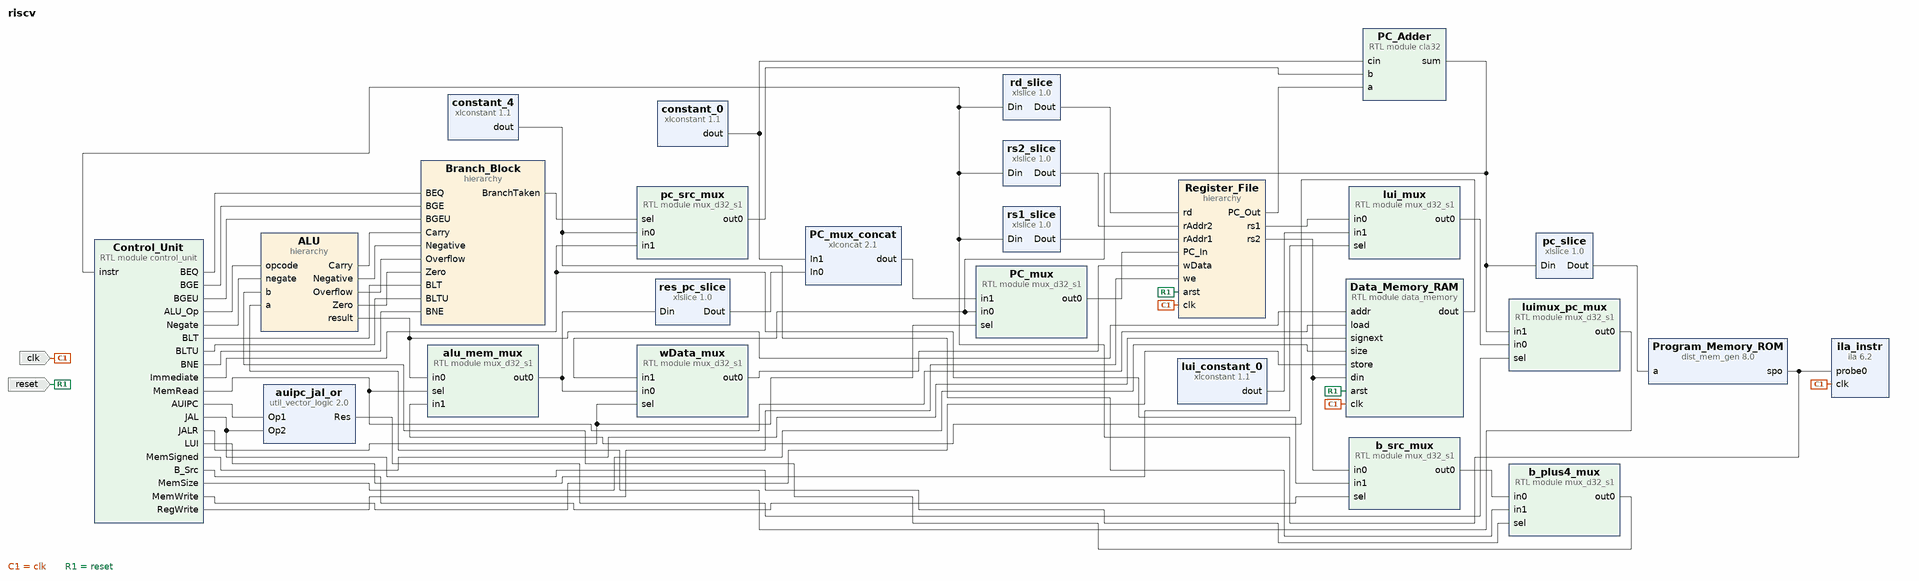
[diagram p0: block diagram of the top level]
# Vivado block design riscv, xc7z020clg400-1, Vivado 2024.1
create_bd_design riscv

create_bd_port -dir I -type clk clk
create_bd_port -dir I reset

create_bd_cell -type module -reference data_memory Data_Memory_RAM
create_bd_cell -type hier Register_File
create_bd_cell -type hier ALU
create_bd_cell -type ip -vlnv xilinx.com:ip:dist_mem_gen:8.0 Program_Memory_ROM
set_property -dict [list \
  CONFIG.coefficient_file Test_Programs/RV32I/rv32ui-p-addi.coe \
  CONFIG.data_width 32 \
  CONFIG.depth 1024 \
  CONFIG.memory_type rom \
] [get_bd_cells Program_Memory_ROM]
create_bd_cell -type module -reference control_unit Control_Unit
create_bd_cell -type ip -vlnv xilinx.com:ip:xlslice:1.0 pc_slice
set_property -dict {CONFIG.DIN_FROM 9 CONFIG.DOUT_WIDTH 10} [get_bd_cells pc_slice]
create_bd_cell -type module -reference cla32 PC_Adder
create_bd_cell -type ip -vlnv xilinx.com:ip:xlconstant:1.1 constant_4
set_property -dict {CONFIG.CONST_VAL 4 CONFIG.CONST_WIDTH 32} [get_bd_cells constant_4]
create_bd_cell -type ip -vlnv xilinx.com:ip:xlconstant:1.1 constant_0
set_property -dict {CONFIG.CONST_VAL 0 CONFIG.CONST_WIDTH 1} [get_bd_cells constant_0]
create_bd_cell -type ip -vlnv xilinx.com:ip:xlslice:1.0 rd_slice
set_property -dict {CONFIG.DIN_FROM 11 CONFIG.DIN_TO 7} [get_bd_cells rd_slice]
create_bd_cell -type ip -vlnv xilinx.com:ip:xlslice:1.0 rs1_slice
set_property -dict {CONFIG.DIN_FROM 19 CONFIG.DIN_TO 15} [get_bd_cells rs1_slice]
create_bd_cell -type ip -vlnv xilinx.com:ip:xlslice:1.0 rs2_slice
set_property -dict {CONFIG.DIN_FROM 24 CONFIG.DIN_TO 20} [get_bd_cells rs2_slice]
create_bd_cell -type module -reference mux_d32_s1 b_src_mux
create_bd_cell -type module -reference mux_d32_s1 alu_mem_mux
create_bd_cell -type hier Branch_Block
create_bd_cell -type module -reference mux_d32_s1 pc_src_mux
create_bd_cell -type module -reference mux_d32_s1 lui_mux
create_bd_cell -type ip -vlnv xilinx.com:ip:xlconstant:1.1 lui_constant_0
set_property -dict {CONFIG.CONST_VAL 0 CONFIG.CONST_WIDTH 32} [get_bd_cells lui_constant_0]
create_bd_cell -type ip -vlnv xilinx.com:ip:util_vector_logic:2.0 auipc_jal_or
set_property -dict {CONFIG.C_OPERATION or CONFIG.C_SIZE 1} [get_bd_cells auipc_jal_or]
create_bd_cell -type module -reference mux_d32_s1 luimux_pc_mux
create_bd_cell -type module -reference mux_d32_s1 b_plus4_mux
create_bd_cell -type module -reference mux_d32_s1 wData_mux
create_bd_cell -type module -reference mux_d32_s1 PC_mux
create_bd_cell -type ip -vlnv xilinx.com:ip:xlconcat:2.1 PC_mux_concat
set_property -dict {CONFIG.IN0_WIDTH 31 CONFIG.IN1_WIDTH 1} [get_bd_cells PC_mux_concat]
create_bd_cell -type ip -vlnv xilinx.com:ip:xlslice:1.0 res_pc_slice
set_property -dict {CONFIG.DIN_FROM 31 CONFIG.DIN_TO 1} [get_bd_cells res_pc_slice]
create_bd_cell -type ip -vlnv xilinx.com:ip:ila:6.2 ila_instr
set_property -dict {CONFIG.C_MONITOR_TYPE Native CONFIG.C_PROBE0_WIDTH 32} [get_bd_cells ila_instr]

# ---- hierarchy /Register_File ----
current_bd_instance /Register_File
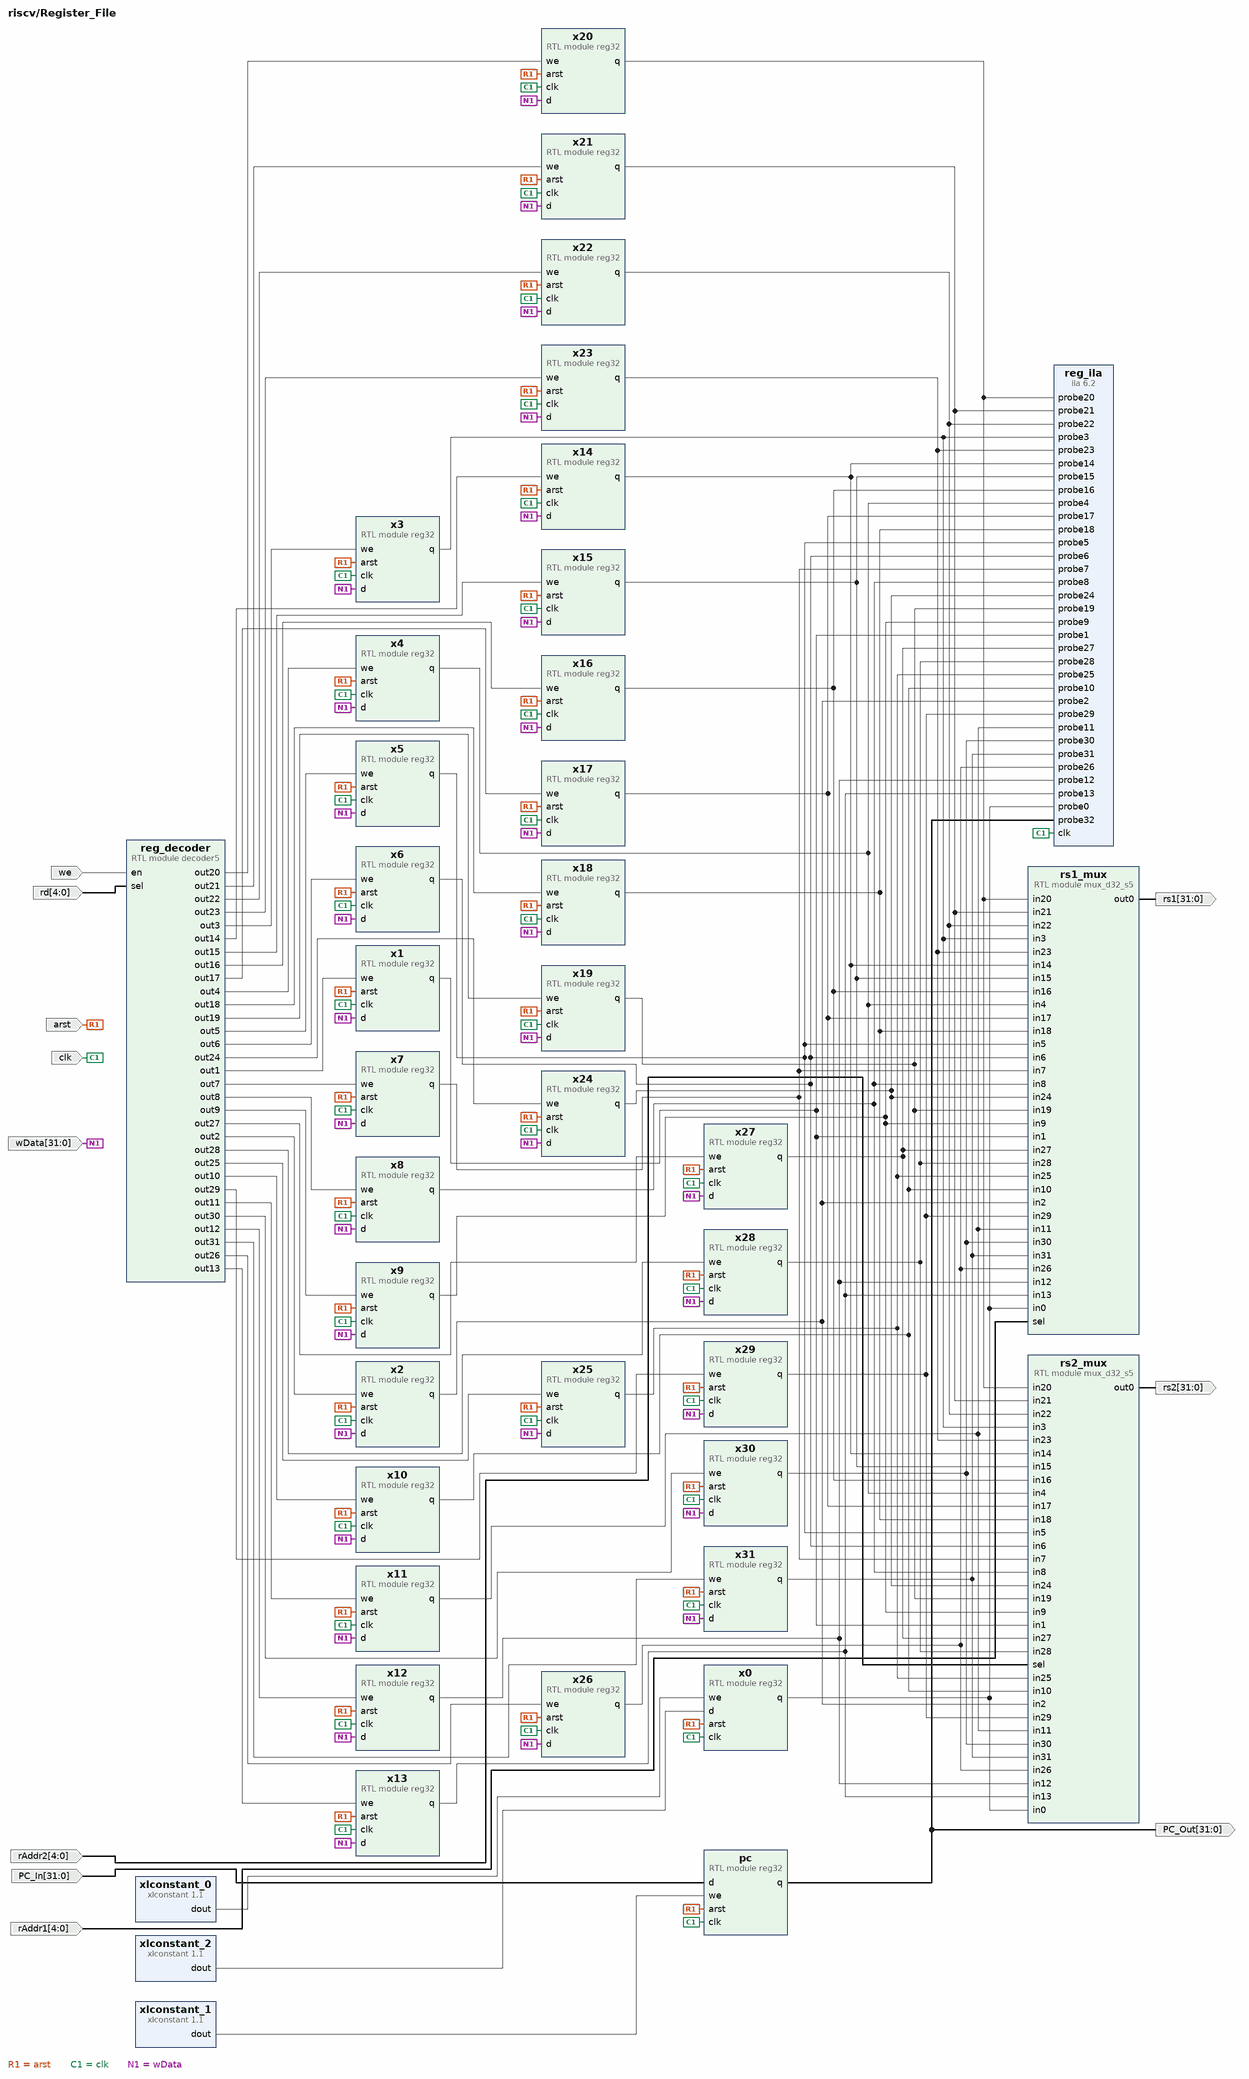
[diagram p1: block diagram inside /Register_File]
create_bd_pin -dir I -type clk clk
create_bd_pin -dir I arst
create_bd_pin -dir I -from 31 -to 0 wData
create_bd_pin -dir O -from 31 -to 0 PC_Out
create_bd_pin -dir I -from 31 -to 0 PC_In
create_bd_pin -dir I we
create_bd_pin -dir I -from 4 -to 0 rd
create_bd_pin -dir O -from 31 -to 0 rs1
create_bd_pin -dir O -from 31 -to 0 rs2
create_bd_pin -dir I -from 4 -to 0 rAddr1
create_bd_pin -dir I -from 4 -to 0 rAddr2

create_bd_cell -type module -reference reg32 x0
create_bd_cell -type module -reference reg32 x1
create_bd_cell -type module -reference reg32 x2
create_bd_cell -type module -reference reg32 x3
create_bd_cell -type module -reference reg32 x4
create_bd_cell -type module -reference reg32 x5
create_bd_cell -type module -reference reg32 x6
create_bd_cell -type module -reference reg32 x7
create_bd_cell -type module -reference reg32 x8
create_bd_cell -type module -reference reg32 x9
create_bd_cell -type module -reference reg32 x10
create_bd_cell -type module -reference reg32 x11
create_bd_cell -type module -reference reg32 x12
create_bd_cell -type module -reference reg32 x13
create_bd_cell -type module -reference reg32 x14
create_bd_cell -type module -reference reg32 x15
create_bd_cell -type module -reference reg32 x16
create_bd_cell -type module -reference reg32 x17
create_bd_cell -type module -reference reg32 x18
create_bd_cell -type module -reference reg32 x19
create_bd_cell -type module -reference reg32 x20
create_bd_cell -type module -reference reg32 x21
create_bd_cell -type module -reference reg32 x22
create_bd_cell -type module -reference reg32 x23
create_bd_cell -type module -reference reg32 x24
create_bd_cell -type module -reference reg32 x25
create_bd_cell -type module -reference reg32 x26
create_bd_cell -type module -reference reg32 x27
create_bd_cell -type module -reference reg32 x28
create_bd_cell -type module -reference reg32 x29
create_bd_cell -type module -reference reg32 x30
create_bd_cell -type module -reference reg32 x31
create_bd_cell -type module -reference reg32 pc
create_bd_cell -type ip -vlnv xilinx.com:ip:xlconstant:1.1 xlconstant_0
set_property -dict {CONFIG.CONST_VAL 0} [get_bd_cells xlconstant_0]
create_bd_cell -type ip -vlnv xilinx.com:ip:xlconstant:1.1 xlconstant_1
set_property -dict {CONFIG.CONST_VAL 1} [get_bd_cells xlconstant_1]
create_bd_cell -type module -reference decoder5 reg_decoder
create_bd_cell -type module -reference mux_d32_s5 rs1_mux
create_bd_cell -type module -reference mux_d32_s5 rs2_mux
create_bd_cell -type ip -vlnv xilinx.com:ip:xlconstant:1.1 xlconstant_2
set_property -dict {CONFIG.CONST_VAL 0 CONFIG.CONST_WIDTH 32} [get_bd_cells xlconstant_2]
create_bd_cell -type ip -vlnv xilinx.com:ip:ila:6.2 reg_ila
set_property -dict [list \
  CONFIG.C_MONITOR_TYPE Native \
  CONFIG.C_NUM_OF_PROBES 33 \
  CONFIG.C_PROBE0_WIDTH 32 \
  CONFIG.C_PROBE10_WIDTH 32 \
  CONFIG.C_PROBE11_WIDTH 32 \
  CONFIG.C_PROBE12_WIDTH 32 \
  CONFIG.C_PROBE13_WIDTH 32 \
  CONFIG.C_PROBE14_WIDTH 32 \
  CONFIG.C_PROBE15_WIDTH 32 \
  CONFIG.C_PROBE16_WIDTH 32 \
  CONFIG.C_PROBE17_WIDTH 32 \
  CONFIG.C_PROBE18_WIDTH 32 \
  CONFIG.C_PROBE19_WIDTH 32 \
  CONFIG.C_PROBE1_WIDTH 32 \
  CONFIG.C_PROBE20_WIDTH 32 \
  CONFIG.C_PROBE21_WIDTH 32 \
  CONFIG.C_PROBE22_WIDTH 32 \
  CONFIG.C_PROBE23_WIDTH 32 \
  CONFIG.C_PROBE24_WIDTH 32 \
  CONFIG.C_PROBE25_WIDTH 32 \
  CONFIG.C_PROBE26_WIDTH 32 \
  CONFIG.C_PROBE27_WIDTH 32 \
  CONFIG.C_PROBE28_WIDTH 32 \
  CONFIG.C_PROBE29_WIDTH 32 \
  CONFIG.C_PROBE2_WIDTH 32 \
  CONFIG.C_PROBE30_WIDTH 32 \
  CONFIG.C_PROBE31_WIDTH 32 \
  CONFIG.C_PROBE32_WIDTH 32 \
  CONFIG.C_PROBE3_WIDTH 32 \
  CONFIG.C_PROBE4_WIDTH 32 \
  CONFIG.C_PROBE5_WIDTH 32 \
  CONFIG.C_PROBE6_WIDTH 32 \
  CONFIG.C_PROBE7_WIDTH 32 \
  CONFIG.C_PROBE8_WIDTH 32 \
  CONFIG.C_PROBE9_WIDTH 32 \
] [get_bd_cells reg_ila]

# ---- hierarchy /ALU ----
current_bd_instance /ALU
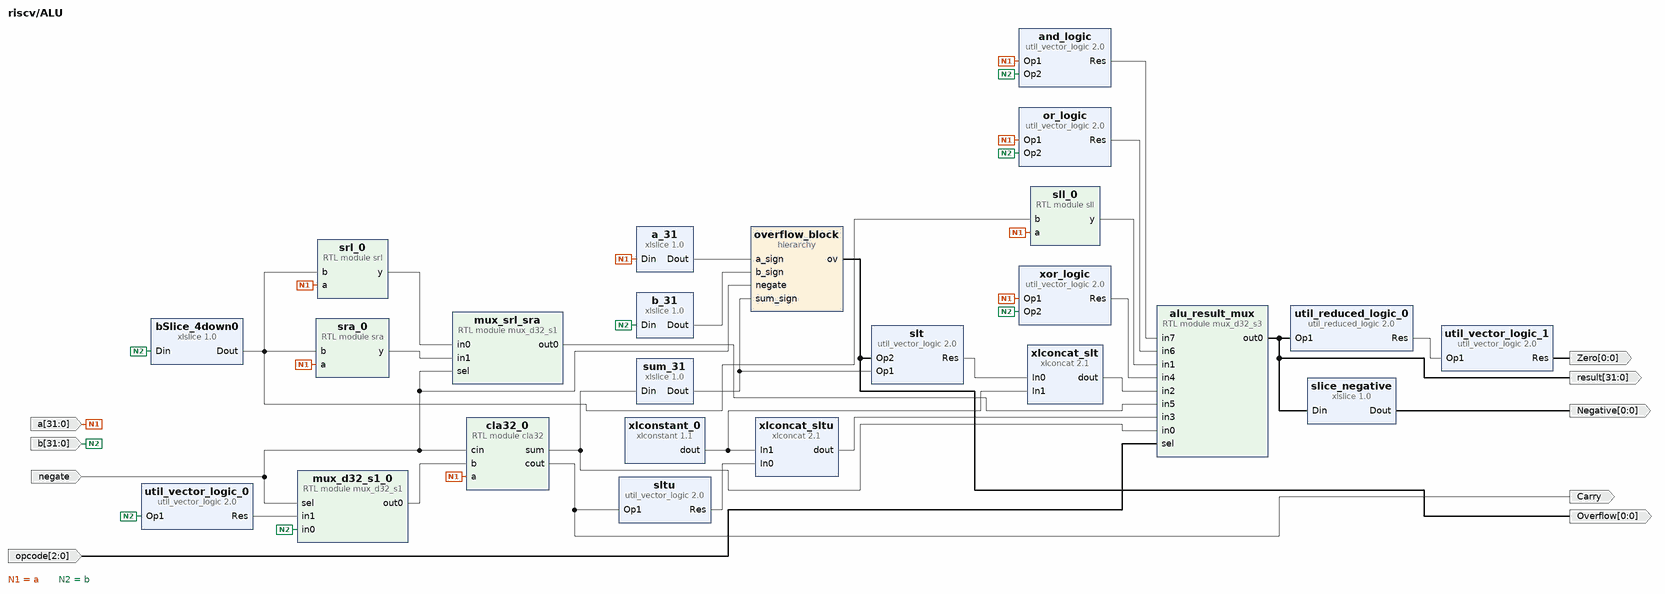
[diagram p2: block diagram inside /ALU]
create_bd_pin -dir I -from 31 -to 0 a
create_bd_pin -dir I -from 31 -to 0 b
create_bd_pin -dir I negate
create_bd_pin -dir I -from 2 -to 0 opcode
create_bd_pin -dir O -from 31 -to 0 result
create_bd_pin -dir O Carry
create_bd_pin -dir O -from 0 -to 0 Negative
create_bd_pin -dir O -from 0 -to 0 Zero
create_bd_pin -dir O -from 0 -to 0 Overflow

create_bd_cell -type module -reference cla32 cla32_0
create_bd_cell -type module -reference mux_d32_s1 mux_d32_s1_0
create_bd_cell -type module -reference sll sll_0
create_bd_cell -type ip -vlnv xilinx.com:ip:xlslice:1.0 bSlice_4down0
set_property -dict {CONFIG.DIN_FROM 4} [get_bd_cells bSlice_4down0]
create_bd_cell -type ip -vlnv xilinx.com:ip:util_vector_logic:2.0 slt
set_property -dict {CONFIG.C_OPERATION xor CONFIG.C_SIZE 1} [get_bd_cells slt]
create_bd_cell -type ip -vlnv xilinx.com:ip:util_vector_logic:2.0 sltu
set_property -dict {CONFIG.C_OPERATION not CONFIG.C_SIZE 1} [get_bd_cells sltu]
create_bd_cell -type ip -vlnv xilinx.com:ip:xlconcat:2.1 xlconcat_slt
set_property -dict {CONFIG.IN0_WIDTH 1 CONFIG.IN1_WIDTH 31} [get_bd_cells xlconcat_slt]
create_bd_cell -type ip -vlnv xilinx.com:ip:xlconstant:1.1 xlconstant_0
set_property -dict {CONFIG.CONST_VAL 0 CONFIG.CONST_WIDTH 31} [get_bd_cells xlconstant_0]
create_bd_cell -type ip -vlnv xilinx.com:ip:xlconcat:2.1 xlconcat_sltu
set_property -dict {CONFIG.IN0_WIDTH 1 CONFIG.IN1_WIDTH 31} [get_bd_cells xlconcat_sltu]
create_bd_cell -type ip -vlnv xilinx.com:ip:xlslice:1.0 sum_31
set_property -dict {CONFIG.DIN_FROM 31 CONFIG.DIN_TO 31} [get_bd_cells sum_31]
create_bd_cell -type ip -vlnv xilinx.com:ip:util_vector_logic:2.0 xor_logic
set_property -dict {CONFIG.C_OPERATION xor CONFIG.C_SIZE 32} [get_bd_cells xor_logic]
create_bd_cell -type module -reference srl srl_0
create_bd_cell -type module -reference sra sra_0
create_bd_cell -type module -reference mux_d32_s1 mux_srl_sra
create_bd_cell -type ip -vlnv xilinx.com:ip:util_vector_logic:2.0 or_logic
set_property -dict {CONFIG.C_OPERATION or CONFIG.C_SIZE 32} [get_bd_cells or_logic]
create_bd_cell -type ip -vlnv xilinx.com:ip:util_vector_logic:2.0 and_logic
set_property -dict {CONFIG.C_SIZE 32} [get_bd_cells and_logic]
create_bd_cell -type module -reference mux_d32_s3 alu_result_mux
create_bd_cell -type ip -vlnv xilinx.com:ip:xlslice:1.0 slice_negative
set_property -dict {CONFIG.DIN_FROM 31 CONFIG.DIN_TO 31} [get_bd_cells slice_negative]
create_bd_cell -type ip -vlnv xilinx.com:ip:util_reduced_logic:2.0 util_reduced_logic_0
set_property -dict {CONFIG.C_OPERATION or CONFIG.C_SIZE 32} [get_bd_cells util_reduced_logic_0]
create_bd_cell -type ip -vlnv xilinx.com:ip:util_vector_logic:2.0 util_vector_logic_1
set_property -dict {CONFIG.C_OPERATION not CONFIG.C_SIZE 1} [get_bd_cells util_vector_logic_1]
create_bd_cell -type hier overflow_block
create_bd_cell -type ip -vlnv xilinx.com:ip:xlslice:1.0 a_31
set_property -dict {CONFIG.DIN_FROM 31 CONFIG.DIN_TO 31} [get_bd_cells a_31]
create_bd_cell -type ip -vlnv xilinx.com:ip:xlslice:1.0 b_31
set_property -dict {CONFIG.DIN_FROM 31 CONFIG.DIN_TO 31} [get_bd_cells b_31]
create_bd_cell -type ip -vlnv xilinx.com:ip:util_vector_logic:2.0 util_vector_logic_0
set_property -dict {CONFIG.C_OPERATION not CONFIG.C_SIZE 32} [get_bd_cells util_vector_logic_0]

# ---- hierarchy /ALU/overflow_block ----
current_bd_instance /ALU/overflow_block
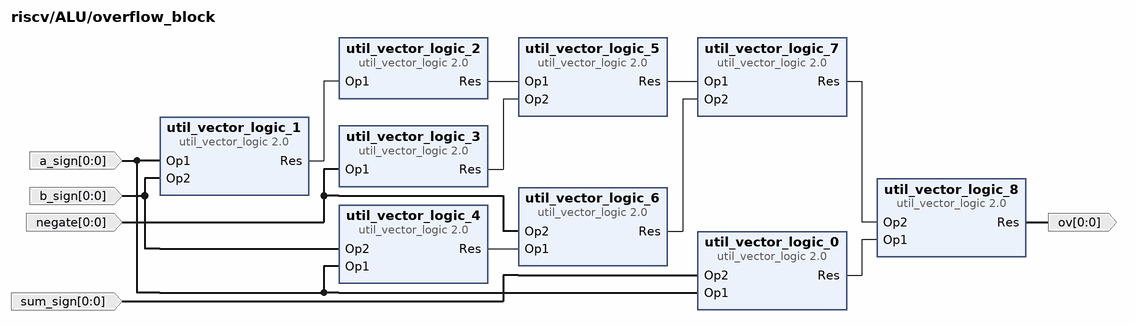
[diagram p3: block diagram inside /ALU/overflow_block]
create_bd_pin -dir I -from 0 -to 0 a_sign
create_bd_pin -dir I -from 0 -to 0 b_sign
create_bd_pin -dir I -from 0 -to 0 sum_sign
create_bd_pin -dir O -from 0 -to 0 ov
create_bd_pin -dir I -from 0 -to 0 negate

create_bd_cell -type ip -vlnv xilinx.com:ip:util_vector_logic:2.0 util_vector_logic_0
set_property -dict {CONFIG.C_OPERATION xor CONFIG.C_SIZE 1} [get_bd_cells util_vector_logic_0]
create_bd_cell -type ip -vlnv xilinx.com:ip:util_vector_logic:2.0 util_vector_logic_1
set_property -dict {CONFIG.C_OPERATION xor CONFIG.C_SIZE 1} [get_bd_cells util_vector_logic_1]
create_bd_cell -type ip -vlnv xilinx.com:ip:util_vector_logic:2.0 util_vector_logic_2
set_property -dict {CONFIG.C_OPERATION not CONFIG.C_SIZE 1} [get_bd_cells util_vector_logic_2]
create_bd_cell -type ip -vlnv xilinx.com:ip:util_vector_logic:2.0 util_vector_logic_3
set_property -dict {CONFIG.C_OPERATION not CONFIG.C_SIZE 1} [get_bd_cells util_vector_logic_3]
create_bd_cell -type ip -vlnv xilinx.com:ip:util_vector_logic:2.0 util_vector_logic_4
set_property -dict {CONFIG.C_OPERATION xor CONFIG.C_SIZE 1} [get_bd_cells util_vector_logic_4]
create_bd_cell -type ip -vlnv xilinx.com:ip:util_vector_logic:2.0 util_vector_logic_5
set_property -dict {CONFIG.C_OPERATION and CONFIG.C_SIZE 1} [get_bd_cells util_vector_logic_5]
create_bd_cell -type ip -vlnv xilinx.com:ip:util_vector_logic:2.0 util_vector_logic_6
set_property -dict {CONFIG.C_OPERATION and CONFIG.C_SIZE 1} [get_bd_cells util_vector_logic_6]
create_bd_cell -type ip -vlnv xilinx.com:ip:util_vector_logic:2.0 util_vector_logic_7
set_property -dict {CONFIG.C_OPERATION or CONFIG.C_SIZE 1} [get_bd_cells util_vector_logic_7]
create_bd_cell -type ip -vlnv xilinx.com:ip:util_vector_logic:2.0 util_vector_logic_8
set_property -dict {CONFIG.C_OPERATION and CONFIG.C_SIZE 1} [get_bd_cells util_vector_logic_8]

# ---- hierarchy /Branch_Block ----
current_bd_instance /Branch_Block
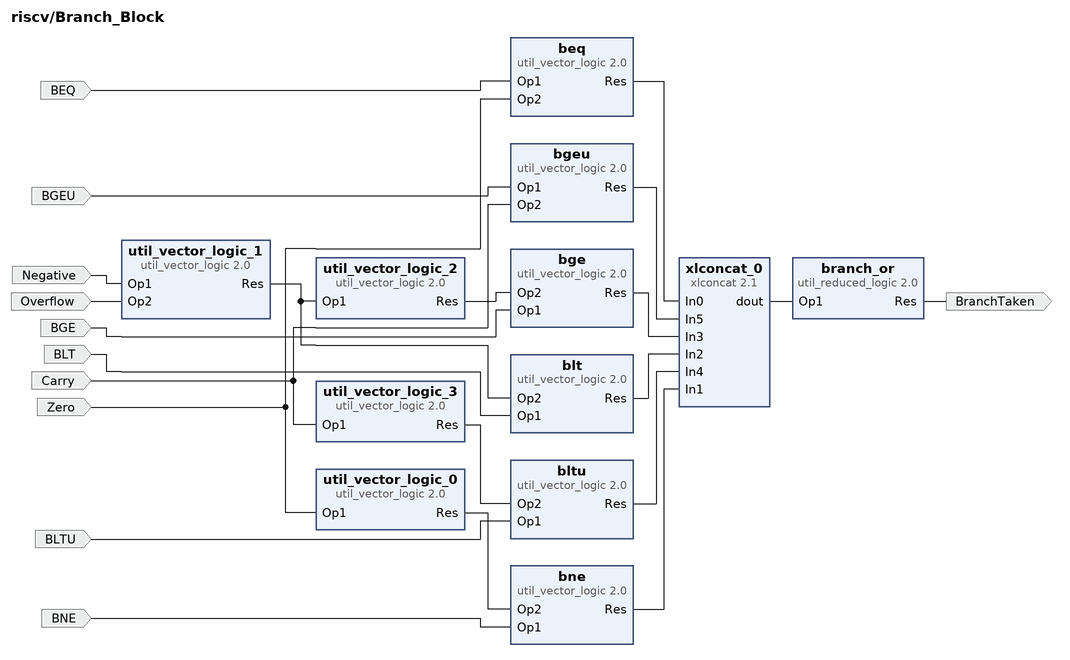
[diagram p4: block diagram inside /Branch_Block]
create_bd_pin -dir I Negative
create_bd_pin -dir I Zero
create_bd_pin -dir I Carry
create_bd_pin -dir I Overflow
create_bd_pin -dir I BEQ
create_bd_pin -dir I BNE
create_bd_pin -dir I BLT
create_bd_pin -dir I BGE
create_bd_pin -dir I BLTU
create_bd_pin -dir I BGEU
create_bd_pin -dir O BranchTaken

create_bd_cell -type ip -vlnv xilinx.com:ip:util_vector_logic:2.0 beq
set_property -dict {CONFIG.C_SIZE 1} [get_bd_cells beq]
create_bd_cell -type ip -vlnv xilinx.com:ip:util_vector_logic:2.0 bne
set_property -dict {CONFIG.C_SIZE 1} [get_bd_cells bne]
create_bd_cell -type ip -vlnv xilinx.com:ip:util_vector_logic:2.0 bltu
set_property -dict {CONFIG.C_SIZE 1} [get_bd_cells bltu]
create_bd_cell -type ip -vlnv xilinx.com:ip:util_vector_logic:2.0 blt
set_property -dict {CONFIG.C_SIZE 1} [get_bd_cells blt]
create_bd_cell -type ip -vlnv xilinx.com:ip:util_vector_logic:2.0 bge
set_property -dict {CONFIG.C_SIZE 1} [get_bd_cells bge]
create_bd_cell -type ip -vlnv xilinx.com:ip:util_vector_logic:2.0 bgeu
set_property -dict {CONFIG.C_SIZE 1} [get_bd_cells bgeu]
create_bd_cell -type ip -vlnv xilinx.com:ip:xlconcat:2.1 xlconcat_0
set_property -dict {CONFIG.NUM_PORTS 6} [get_bd_cells xlconcat_0]
create_bd_cell -type ip -vlnv xilinx.com:ip:util_reduced_logic:2.0 branch_or
set_property -dict {CONFIG.C_OPERATION or CONFIG.C_SIZE 6} [get_bd_cells branch_or]
create_bd_cell -type ip -vlnv xilinx.com:ip:util_vector_logic:2.0 util_vector_logic_0
set_property -dict {CONFIG.C_OPERATION not CONFIG.C_SIZE 1} [get_bd_cells util_vector_logic_0]
create_bd_cell -type ip -vlnv xilinx.com:ip:util_vector_logic:2.0 util_vector_logic_1
set_property -dict {CONFIG.C_OPERATION xor CONFIG.C_SIZE 1} [get_bd_cells util_vector_logic_1]
create_bd_cell -type ip -vlnv xilinx.com:ip:util_vector_logic:2.0 util_vector_logic_2
set_property -dict {CONFIG.C_OPERATION not CONFIG.C_SIZE 1} [get_bd_cells util_vector_logic_2]
create_bd_cell -type ip -vlnv xilinx.com:ip:util_vector_logic:2.0 util_vector_logic_3
set_property -dict {CONFIG.C_OPERATION not CONFIG.C_SIZE 1} [get_bd_cells util_vector_logic_3]

# ---- connections ----

current_bd_instance /Register_File
connect_bd_net [get_bd_pins x20/q] [get_bd_pins reg_ila/probe20] [get_bd_pins rs1_mux/in20] [get_bd_pins rs2_mux/in20]
connect_bd_net [get_bd_pins x3/q] [get_bd_pins reg_ila/probe3] [get_bd_pins rs1_mux/in3] [get_bd_pins rs2_mux/in3]
connect_bd_net [get_bd_pins x4/q] [get_bd_pins reg_ila/probe4] [get_bd_pins rs1_mux/in4] [get_bd_pins rs2_mux/in4]
connect_bd_net [get_bd_pins x0/q] [get_bd_pins reg_ila/probe0] [get_bd_pins rs1_mux/in0] [get_bd_pins rs2_mux/in0]
connect_bd_net [get_bd_pins x5/q] [get_bd_pins reg_ila/probe5] [get_bd_pins rs1_mux/in5] [get_bd_pins rs2_mux/in5]
connect_bd_net [get_bd_pins x6/q] [get_bd_pins reg_ila/probe6] [get_bd_pins rs1_mux/in6] [get_bd_pins rs2_mux/in6]
connect_bd_net [get_bd_pins x7/q] [get_bd_pins reg_ila/probe7] [get_bd_pins rs1_mux/in7] [get_bd_pins rs2_mux/in7]
connect_bd_net [get_bd_pins x8/q] [get_bd_pins reg_ila/probe8] [get_bd_pins rs1_mux/in8] [get_bd_pins rs2_mux/in8]
connect_bd_net [get_bd_pins x9/q] [get_bd_pins reg_ila/probe9] [get_bd_pins rs1_mux/in9] [get_bd_pins rs2_mux/in9]
connect_bd_net [get_bd_pins x21/q] [get_bd_pins reg_ila/probe21] [get_bd_pins rs1_mux/in21] [get_bd_pins rs2_mux/in21]
connect_bd_net [get_bd_pins x22/q] [get_bd_pins reg_ila/probe22] [get_bd_pins rs1_mux/in22] [get_bd_pins rs2_mux/in22]
connect_bd_net [get_bd_pins x23/q] [get_bd_pins reg_ila/probe23] [get_bd_pins rs1_mux/in23] [get_bd_pins rs2_mux/in23]
connect_bd_net [get_bd_pins x24/q] [get_bd_pins reg_ila/probe24] [get_bd_pins rs1_mux/in24] [get_bd_pins rs2_mux/in24]
connect_bd_net [get_bd_pins x25/q] [get_bd_pins reg_ila/probe25] [get_bd_pins rs1_mux/in25] [get_bd_pins rs2_mux/in25]
connect_bd_net [get_bd_pins x26/q] [get_bd_pins reg_ila/probe26] [get_bd_pins rs1_mux/in26] [get_bd_pins rs2_mux/in26]
connect_bd_net [get_bd_pins x27/q] [get_bd_pins reg_ila/probe27] [get_bd_pins rs1_mux/in27] [get_bd_pins rs2_mux/in27]
connect_bd_net [get_bd_pins x28/q] [get_bd_pins reg_ila/probe28] [get_bd_pins rs1_mux/in28] [get_bd_pins rs2_mux/in28]
connect_bd_net [get_bd_pins x29/q] [get_bd_pins reg_ila/probe29] [get_bd_pins rs1_mux/in29] [get_bd_pins rs2_mux/in29]
connect_bd_net [get_bd_pins x30/q] [get_bd_pins reg_ila/probe30] [get_bd_pins rs1_mux/in30] [get_bd_pins rs2_mux/in30]
connect_bd_net [get_bd_pins x31/q] [get_bd_pins reg_ila/probe31] [get_bd_pins rs1_mux/in31] [get_bd_pins rs2_mux/in31]
connect_bd_net -net arst_0_1 [get_bd_pins arst] \
  [get_bd_pins x0/arst] [get_bd_pins x1/arst] [get_bd_pins x2/arst] [get_bd_pins x3/arst] [get_bd_pins x12/arst] \
  [get_bd_pins x13/arst] [get_bd_pins x14/arst] [get_bd_pins x15/arst] [get_bd_pins x16/arst] [get_bd_pins x17/arst] \
  [get_bd_pins x18/arst] [get_bd_pins x19/arst] [get_bd_pins x20/arst] [get_bd_pins x21/arst] [get_bd_pins x4/arst] \
  [get_bd_pins x22/arst] [get_bd_pins x23/arst] [get_bd_pins x24/arst] [get_bd_pins x25/arst] [get_bd_pins x26/arst] \
  [get_bd_pins x27/arst] [get_bd_pins x28/arst] [get_bd_pins x29/arst] [get_bd_pins x30/arst] [get_bd_pins x31/arst] \
  [get_bd_pins x5/arst] [get_bd_pins x6/arst] [get_bd_pins x7/arst] [get_bd_pins x8/arst] [get_bd_pins x9/arst] \
  [get_bd_pins x10/arst] [get_bd_pins x11/arst] [get_bd_pins pc/arst]
connect_bd_net -net clk_0_1 [get_bd_pins clk] \
  [get_bd_pins x0/clk] [get_bd_pins x1/clk] [get_bd_pins x2/clk] [get_bd_pins x3/clk] [get_bd_pins x12/clk] \
  [get_bd_pins x13/clk] [get_bd_pins x14/clk] [get_bd_pins x15/clk] [get_bd_pins x16/clk] [get_bd_pins x17/clk] \
  [get_bd_pins x18/clk] [get_bd_pins x19/clk] [get_bd_pins x20/clk] [get_bd_pins x21/clk] [get_bd_pins x4/clk] \
  [get_bd_pins x22/clk] [get_bd_pins x23/clk] [get_bd_pins x24/clk] [get_bd_pins x25/clk] [get_bd_pins x26/clk] \
  [get_bd_pins x27/clk] [get_bd_pins x28/clk] [get_bd_pins x29/clk] [get_bd_pins x30/clk] [get_bd_pins x31/clk] \
  [get_bd_pins x5/clk] [get_bd_pins x6/clk] [get_bd_pins x7/clk] [get_bd_pins x8/clk] [get_bd_pins x9/clk] \
  [get_bd_pins x10/clk] [get_bd_pins x11/clk] [get_bd_pins pc/clk] [get_bd_pins reg_ila/clk]
connect_bd_net -net d_1 [get_bd_pins wData] \
  [get_bd_pins x1/d] [get_bd_pins x2/d] [get_bd_pins x3/d] [get_bd_pins x12/d] [get_bd_pins x13/d] [get_bd_pins x14/d] \
  [get_bd_pins x15/d] [get_bd_pins x16/d] [get_bd_pins x17/d] [get_bd_pins x18/d] [get_bd_pins x19/d] [get_bd_pins x20/d] \
  [get_bd_pins x21/d] [get_bd_pins x4/d] [get_bd_pins x22/d] [get_bd_pins x23/d] [get_bd_pins x24/d] [get_bd_pins x25/d] \
  [get_bd_pins x26/d] [get_bd_pins x27/d] [get_bd_pins x28/d] [get_bd_pins x29/d] [get_bd_pins x30/d] [get_bd_pins x31/d] \
  [get_bd_pins x5/d] [get_bd_pins x6/d] [get_bd_pins x7/d] [get_bd_pins x8/d] [get_bd_pins x9/d] [get_bd_pins x10/d] \
  [get_bd_pins x11/d]
connect_bd_net -net d_2 [get_bd_pins PC_In] [get_bd_pins pc/d]
connect_bd_net -net en_1 [get_bd_pins we] [get_bd_pins reg_decoder/en]
connect_bd_net [get_bd_pins pc/q] [get_bd_pins PC_Out] [get_bd_pins reg_ila/probe32]
connect_bd_net [get_bd_pins reg_decoder/out1] [get_bd_pins x1/we]
connect_bd_net [get_bd_pins reg_decoder/out2] [get_bd_pins x2/we]
connect_bd_net [get_bd_pins reg_decoder/out3] [get_bd_pins x3/we]
connect_bd_net [get_bd_pins reg_decoder/out4] [get_bd_pins x4/we]
connect_bd_net [get_bd_pins reg_decoder/out5] [get_bd_pins x5/we]
connect_bd_net [get_bd_pins reg_decoder/out6] [get_bd_pins x6/we]
connect_bd_net [get_bd_pins reg_decoder/out7] [get_bd_pins x7/we]
connect_bd_net [get_bd_pins reg_decoder/out8] [get_bd_pins x8/we]
connect_bd_net [get_bd_pins reg_decoder/out9] [get_bd_pins x9/we]
connect_bd_net [get_bd_pins reg_decoder/out10] [get_bd_pins x10/we]
connect_bd_net [get_bd_pins reg_decoder/out11] [get_bd_pins x11/we]
connect_bd_net [get_bd_pins reg_decoder/out12] [get_bd_pins x12/we]
connect_bd_net [get_bd_pins reg_decoder/out13] [get_bd_pins x13/we]
connect_bd_net [get_bd_pins reg_decoder/out14] [get_bd_pins x14/we]
connect_bd_net [get_bd_pins reg_decoder/out15] [get_bd_pins x15/we]
connect_bd_net [get_bd_pins reg_decoder/out16] [get_bd_pins x16/we]
connect_bd_net [get_bd_pins reg_decoder/out17] [get_bd_pins x17/we]
connect_bd_net [get_bd_pins reg_decoder/out18] [get_bd_pins x18/we]
connect_bd_net [get_bd_pins reg_decoder/out19] [get_bd_pins x19/we]
connect_bd_net [get_bd_pins reg_decoder/out20] [get_bd_pins x20/we]
connect_bd_net [get_bd_pins reg_decoder/out21] [get_bd_pins x21/we]
connect_bd_net [get_bd_pins reg_decoder/out22] [get_bd_pins x22/we]
connect_bd_net [get_bd_pins reg_decoder/out23] [get_bd_pins x23/we]
connect_bd_net [get_bd_pins reg_decoder/out24] [get_bd_pins x24/we]
connect_bd_net [get_bd_pins reg_decoder/out25] [get_bd_pins x25/we]
connect_bd_net [get_bd_pins reg_decoder/out26] [get_bd_pins x26/we]
connect_bd_net [get_bd_pins reg_decoder/out27] [get_bd_pins x27/we]
connect_bd_net [get_bd_pins reg_decoder/out28] [get_bd_pins x28/we]
connect_bd_net [get_bd_pins reg_decoder/out29] [get_bd_pins x29/we]
connect_bd_net [get_bd_pins reg_decoder/out30] [get_bd_pins x30/we]
connect_bd_net [get_bd_pins reg_decoder/out31] [get_bd_pins x31/we]
connect_bd_net [get_bd_pins rs1_mux/out0] [get_bd_pins rs1]
connect_bd_net [get_bd_pins rs2_mux/out0] [get_bd_pins rs2]
connect_bd_net -net sel_1 [get_bd_pins rd] [get_bd_pins reg_decoder/sel]
connect_bd_net -net sel_2 [get_bd_pins rAddr1] [get_bd_pins rs1_mux/sel]
connect_bd_net -net sel_3 [get_bd_pins rAddr2] [get_bd_pins rs2_mux/sel]
connect_bd_net [get_bd_pins x10/q] [get_bd_pins reg_ila/probe10] [get_bd_pins rs1_mux/in10] [get_bd_pins rs2_mux/in10]
connect_bd_net [get_bd_pins x11/q] [get_bd_pins reg_ila/probe11] [get_bd_pins rs1_mux/in11] [get_bd_pins rs2_mux/in11]
connect_bd_net [get_bd_pins x12/q] [get_bd_pins reg_ila/probe12] [get_bd_pins rs1_mux/in12] [get_bd_pins rs2_mux/in12]
connect_bd_net [get_bd_pins x13/q] [get_bd_pins reg_ila/probe13] [get_bd_pins rs1_mux/in13] [get_bd_pins rs2_mux/in13]
connect_bd_net [get_bd_pins x14/q] [get_bd_pins reg_ila/probe14] [get_bd_pins rs1_mux/in14] [get_bd_pins rs2_mux/in14]
connect_bd_net [get_bd_pins x15/q] [get_bd_pins reg_ila/probe15] [get_bd_pins rs1_mux/in15] [get_bd_pins rs2_mux/in15]
connect_bd_net [get_bd_pins x16/q] [get_bd_pins reg_ila/probe16] [get_bd_pins rs1_mux/in16] [get_bd_pins rs2_mux/in16]
connect_bd_net [get_bd_pins x17/q] [get_bd_pins reg_ila/probe17] [get_bd_pins rs1_mux/in17] [get_bd_pins rs2_mux/in17]
connect_bd_net [get_bd_pins x18/q] [get_bd_pins reg_ila/probe18] [get_bd_pins rs1_mux/in18] [get_bd_pins rs2_mux/in18]
connect_bd_net [get_bd_pins x19/q] [get_bd_pins reg_ila/probe19] [get_bd_pins rs1_mux/in19] [get_bd_pins rs2_mux/in19]
connect_bd_net [get_bd_pins x1/q] [get_bd_pins reg_ila/probe1] [get_bd_pins rs1_mux/in1] [get_bd_pins rs2_mux/in1]
connect_bd_net [get_bd_pins x2/q] [get_bd_pins reg_ila/probe2] [get_bd_pins rs1_mux/in2] [get_bd_pins rs2_mux/in2]
connect_bd_net [get_bd_pins xlconstant_0/dout] [get_bd_pins x0/we]
connect_bd_net [get_bd_pins xlconstant_1/dout] [get_bd_pins pc/we]
connect_bd_net [get_bd_pins xlconstant_2/dout] [get_bd_pins x0/d]

current_bd_instance /ALU
connect_bd_net [get_bd_pins a] \
  [get_bd_pins sll_0/a] [get_bd_pins xor_logic/Op1] [get_bd_pins srl_0/a] [get_bd_pins sra_0/a] [get_bd_pins or_logic/Op1] \
  [get_bd_pins and_logic/Op1] [get_bd_pins a_31/Din] [get_bd_pins cla32_0/a]
connect_bd_net [get_bd_pins a_31/Dout] [get_bd_pins overflow_block/a_sign]
connect_bd_net [get_bd_pins and_logic/Res] [get_bd_pins alu_result_mux/in7]
connect_bd_net [get_bd_pins b] \
  [get_bd_pins bSlice_4down0/Din] [get_bd_pins xor_logic/Op2] [get_bd_pins or_logic/Op2] [get_bd_pins and_logic/Op2] \
  [get_bd_pins b_31/Din] [get_bd_pins util_vector_logic_0/Op1] [get_bd_pins mux_d32_s1_0/in0]
connect_bd_net [get_bd_pins b_31/Dout] [get_bd_pins overflow_block/b_sign]
connect_bd_net [get_bd_pins cla32_0/cout] [get_bd_pins sltu/Op1] [get_bd_pins Carry]
connect_bd_net [get_bd_pins cla32_0/sum] [get_bd_pins sum_31/Din] [get_bd_pins alu_result_mux/in0]
connect_bd_net [get_bd_pins mux_d32_s1_0/out0] [get_bd_pins cla32_0/b]
connect_bd_net -net mux_d32_s3_0_out [get_bd_pins alu_result_mux/out0] \
  [get_bd_pins result] [get_bd_pins slice_negative/Din] [get_bd_pins util_reduced_logic_0/Op1]
connect_bd_net [get_bd_pins mux_srl_sra/out0] [get_bd_pins alu_result_mux/in5]
connect_bd_net [get_bd_pins or_logic/Res] [get_bd_pins alu_result_mux/in6]
connect_bd_net -net overflow_block_Res [get_bd_pins overflow_block/ov] [get_bd_pins slt/Op2] [get_bd_pins Overflow]
connect_bd_net -net sel_1 [get_bd_pins negate] \
  [get_bd_pins cla32_0/cin] [get_bd_pins overflow_block/negate] [get_bd_pins mux_d32_s1_0/sel] [get_bd_pins mux_srl_sra/sel]
connect_bd_net -net sel_2 [get_bd_pins opcode] [get_bd_pins alu_result_mux/sel]
connect_bd_net [get_bd_pins slice_negative/Dout] [get_bd_pins Negative]
connect_bd_net [get_bd_pins sll_0/y] [get_bd_pins alu_result_mux/in1]
connect_bd_net [get_bd_pins slt/Res] [get_bd_pins xlconcat_slt/In0]
connect_bd_net [get_bd_pins sltu/Res] [get_bd_pins xlconcat_sltu/In0]
connect_bd_net [get_bd_pins sra_0/y] [get_bd_pins mux_srl_sra/in1]
connect_bd_net [get_bd_pins srl_0/y] [get_bd_pins mux_srl_sra/in0]
connect_bd_net [get_bd_pins sum_31/Dout] [get_bd_pins slt/Op1] [get_bd_pins overflow_block/sum_sign]
connect_bd_net [get_bd_pins util_reduced_logic_0/Res] [get_bd_pins util_vector_logic_1/Op1]
connect_bd_net [get_bd_pins util_vector_logic_0/Res] [get_bd_pins mux_d32_s1_0/in1]
connect_bd_net [get_bd_pins util_vector_logic_1/Res] [get_bd_pins Zero]
connect_bd_net [get_bd_pins xlconcat_slt/dout] [get_bd_pins alu_result_mux/in2]
connect_bd_net [get_bd_pins xlconcat_sltu/dout] [get_bd_pins alu_result_mux/in3]
connect_bd_net [get_bd_pins xlconstant_0/dout] [get_bd_pins xlconcat_slt/In1] [get_bd_pins xlconcat_sltu/In1]
connect_bd_net -net xlslice_0_Dout [get_bd_pins bSlice_4down0/Dout] [get_bd_pins sll_0/b] [get_bd_pins srl_0/b] [get_bd_pins sra_0/b]
connect_bd_net [get_bd_pins xor_logic/Res] [get_bd_pins alu_result_mux/in4]

current_bd_instance /ALU/overflow_block
connect_bd_net [get_bd_pins negate] [get_bd_pins util_vector_logic_6/Op2] [get_bd_pins util_vector_logic_3/Op1]
connect_bd_net -net Op2_1 [get_bd_pins sum_sign] [get_bd_pins util_vector_logic_0/Op2]
connect_bd_net [get_bd_pins util_vector_logic_0/Res] [get_bd_pins util_vector_logic_8/Op1]
connect_bd_net [get_bd_pins util_vector_logic_1/Res] [get_bd_pins util_vector_logic_2/Op1]
connect_bd_net [get_bd_pins util_vector_logic_2/Res] [get_bd_pins util_vector_logic_5/Op1]
connect_bd_net [get_bd_pins util_vector_logic_3/Res] [get_bd_pins util_vector_logic_5/Op2]
connect_bd_net [get_bd_pins util_vector_logic_4/Res] [get_bd_pins util_vector_logic_6/Op1]
connect_bd_net [get_bd_pins util_vector_logic_5/Res] [get_bd_pins util_vector_logic_7/Op1]
connect_bd_net [get_bd_pins util_vector_logic_6/Res] [get_bd_pins util_vector_logic_7/Op2]
connect_bd_net [get_bd_pins util_vector_logic_7/Res] [get_bd_pins util_vector_logic_8/Op2]
connect_bd_net [get_bd_pins util_vector_logic_8/Res] [get_bd_pins ov]
connect_bd_net -net xlslice_0_Dout [get_bd_pins a_sign] \
  [get_bd_pins util_vector_logic_0/Op1] [get_bd_pins util_vector_logic_1/Op1] [get_bd_pins util_vector_logic_4/Op1]
connect_bd_net -net xlslice_1_Dout [get_bd_pins b_sign] [get_bd_pins util_vector_logic_1/Op2] [get_bd_pins util_vector_logic_4/Op2]

current_bd_instance /Branch_Block
connect_bd_net [get_bd_pins BEQ] [get_bd_pins beq/Op1]
connect_bd_net [get_bd_pins BGEU] [get_bd_pins bgeu/Op1]
connect_bd_net [get_bd_pins BGE] [get_bd_pins bge/Op1]
connect_bd_net [get_bd_pins BLTU] [get_bd_pins bltu/Op1]
connect_bd_net [get_bd_pins BLT] [get_bd_pins blt/Op1]
connect_bd_net [get_bd_pins BNE] [get_bd_pins bne/Op1]
connect_bd_net [get_bd_pins Carry] [get_bd_pins bgeu/Op2] [get_bd_pins util_vector_logic_3/Op1]
connect_bd_net [get_bd_pins Negative] [get_bd_pins util_vector_logic_1/Op1]
connect_bd_net [get_bd_pins Overflow] [get_bd_pins util_vector_logic_1/Op2]
connect_bd_net [get_bd_pins Zero] [get_bd_pins beq/Op2] [get_bd_pins util_vector_logic_0/Op1]
connect_bd_net [get_bd_pins beq/Res] [get_bd_pins xlconcat_0/In0]
connect_bd_net [get_bd_pins bge/Res] [get_bd_pins xlconcat_0/In3]
connect_bd_net [get_bd_pins bgeu/Res] [get_bd_pins xlconcat_0/In5]
connect_bd_net [get_bd_pins blt/Res] [get_bd_pins xlconcat_0/In2]
connect_bd_net [get_bd_pins bltu/Res] [get_bd_pins xlconcat_0/In4]
connect_bd_net [get_bd_pins bne/Res] [get_bd_pins xlconcat_0/In1]
connect_bd_net [get_bd_pins branch_or/Res] [get_bd_pins BranchTaken]
connect_bd_net [get_bd_pins util_vector_logic_0/Res] [get_bd_pins bne/Op2]
connect_bd_net [get_bd_pins util_vector_logic_1/Res] [get_bd_pins blt/Op2] [get_bd_pins util_vector_logic_2/Op1]
connect_bd_net [get_bd_pins util_vector_logic_2/Res] [get_bd_pins bge/Op2]
connect_bd_net [get_bd_pins util_vector_logic_3/Res] [get_bd_pins bltu/Op2]
connect_bd_net [get_bd_pins xlconcat_0/dout] [get_bd_pins branch_or/Op1]

current_bd_instance /
connect_bd_net [get_bd_pins ALU/Carry] [get_bd_pins Branch_Block/Carry]
connect_bd_net [get_bd_pins ALU/Negative] [get_bd_pins Branch_Block/Negative]
connect_bd_net [get_bd_pins ALU/Overflow] [get_bd_pins Branch_Block/Overflow]
connect_bd_net [get_bd_pins ALU/Zero] [get_bd_pins Branch_Block/Zero]
connect_bd_net [get_bd_pins ALU/result] [get_bd_pins Data_Memory_RAM/addr] [get_bd_pins alu_mem_mux/in0]
connect_bd_net -net Branch_Block_Res [get_bd_pins Branch_Block/BranchTaken] [get_bd_pins pc_src_mux/sel]
connect_bd_net [get_bd_pins Control_Unit/ALU_Op] [get_bd_pins ALU/opcode]
connect_bd_net [get_bd_pins Control_Unit/AUIPC] [get_bd_pins auipc_jal_or/Op1]
connect_bd_net [get_bd_pins Control_Unit/BEQ] [get_bd_pins Branch_Block/BEQ]
connect_bd_net [get_bd_pins Control_Unit/BGE] [get_bd_pins Branch_Block/BGE]
connect_bd_net [get_bd_pins Control_Unit/BGEU] [get_bd_pins Branch_Block/BGEU]
connect_bd_net [get_bd_pins Control_Unit/BLT] [get_bd_pins Branch_Block/BLT]
connect_bd_net [get_bd_pins Control_Unit/BLTU] [get_bd_pins Branch_Block/BLTU]
connect_bd_net [get_bd_pins Control_Unit/BNE] [get_bd_pins Branch_Block/BNE]
connect_bd_net [get_bd_pins Control_Unit/B_Src] [get_bd_pins b_src_mux/sel]
connect_bd_net [get_bd_pins Control_Unit/Immediate] [get_bd_pins b_src_mux/in1] [get_bd_pins pc_src_mux/in1]
connect_bd_net [get_bd_pins Control_Unit/JAL] [get_bd_pins auipc_jal_or/Op2] [get_bd_pins b_plus4_mux/sel]
connect_bd_net [get_bd_pins Control_Unit/JALR] [get_bd_pins wData_mux/sel] [get_bd_pins PC_mux/sel]
connect_bd_net [get_bd_pins Control_Unit/LUI] [get_bd_pins lui_mux/sel]
connect_bd_net [get_bd_pins Control_Unit/MemRead] [get_bd_pins Data_Memory_RAM/load] [get_bd_pins alu_mem_mux/sel]
connect_bd_net [get_bd_pins Control_Unit/MemSigned] [get_bd_pins Data_Memory_RAM/signext]
connect_bd_net [get_bd_pins Control_Unit/MemSize] [get_bd_pins Data_Memory_RAM/size]
connect_bd_net [get_bd_pins Control_Unit/MemWrite] [get_bd_pins Data_Memory_RAM/store]
connect_bd_net [get_bd_pins Control_Unit/RegWrite] [get_bd_pins Register_File/we]
connect_bd_net [get_bd_pins Data_Memory_RAM/dout] [get_bd_pins alu_mem_mux/in1]
connect_bd_net [get_bd_pins PC_Adder/sum] \
  [get_bd_pins pc_slice/Din] [get_bd_pins luimux_pc_mux/in1] [get_bd_pins wData_mux/in1] [get_bd_pins PC_mux/in0]
connect_bd_net [get_bd_pins PC_mux_concat/dout] [get_bd_pins PC_mux/in1]
connect_bd_net [get_bd_pins PC_mux/out0] [get_bd_pins Register_File/PC_In]
connect_bd_net [get_bd_pins Program_Memory_ROM/spo] \
  [get_bd_pins rd_slice/Din] [get_bd_pins rs1_slice/Din] [get_bd_pins Control_Unit/instr] [get_bd_pins rs2_slice/Din] \
  [get_bd_pins ila_instr/probe0]
connect_bd_net [get_bd_pins Register_File/PC_Out] [get_bd_pins PC_Adder/a]
connect_bd_net [get_bd_pins Register_File/rs1] [get_bd_pins lui_mux/in0]
connect_bd_net [get_bd_pins Register_File/rs2] [get_bd_pins Data_Memory_RAM/din] [get_bd_pins b_src_mux/in0]
connect_bd_net [get_bd_pins alu_mem_mux/out0] [get_bd_pins res_pc_slice/Din] [get_bd_pins wData_mux/in0]
connect_bd_net [get_bd_pins auipc_jal_or/Res] [get_bd_pins luimux_pc_mux/sel]
connect_bd_net [get_bd_pins b_plus4_mux/out0] [get_bd_pins ALU/b]
connect_bd_net [get_bd_pins b_src_mux/out0] [get_bd_pins b_plus4_mux/in0]
connect_bd_net [get_bd_ports clk] [get_bd_pins Register_File/clk] [get_bd_pins Data_Memory_RAM/clk] [get_bd_pins ila_instr/clk]
connect_bd_net [get_bd_pins constant_4/dout] [get_bd_pins b_plus4_mux/in1] [get_bd_pins pc_src_mux/in0]
connect_bd_net -net constant_5_dout [get_bd_pins constant_0/dout] [get_bd_pins PC_Adder/cin] [get_bd_pins PC_mux_concat/In1]
connect_bd_net [get_bd_pins lui_constant_0/dout] [get_bd_pins lui_mux/in1]
connect_bd_net [get_bd_pins lui_mux/out0] [get_bd_pins luimux_pc_mux/in0]
connect_bd_net [get_bd_pins luimux_pc_mux/out0] [get_bd_pins ALU/a]
connect_bd_net -net negate_1 [get_bd_pins Control_Unit/Negate] [get_bd_pins ALU/negate]
connect_bd_net [get_bd_pins pc_slice/Dout] [get_bd_pins Program_Memory_ROM/a]
connect_bd_net [get_bd_pins pc_src_mux/out0] [get_bd_pins PC_Adder/b]
connect_bd_net [get_bd_pins rd_slice/Dout] [get_bd_pins Register_File/rd]
connect_bd_net [get_bd_pins res_pc_slice/Dout] [get_bd_pins PC_mux_concat/In0]
connect_bd_net [get_bd_ports reset] [get_bd_pins Register_File/arst] [get_bd_pins Data_Memory_RAM/arst]
connect_bd_net [get_bd_pins rs1_slice/Dout] [get_bd_pins Register_File/rAddr1]
connect_bd_net [get_bd_pins rs2_slice/Dout] [get_bd_pins Register_File/rAddr2]
connect_bd_net [get_bd_pins wData_mux/out0] [get_bd_pins Register_File/wData]

validate_bd_design
save_bd_design
